# EAGLE schematic ShieldOV7670FlatCable (EAGLE 9.4.2)
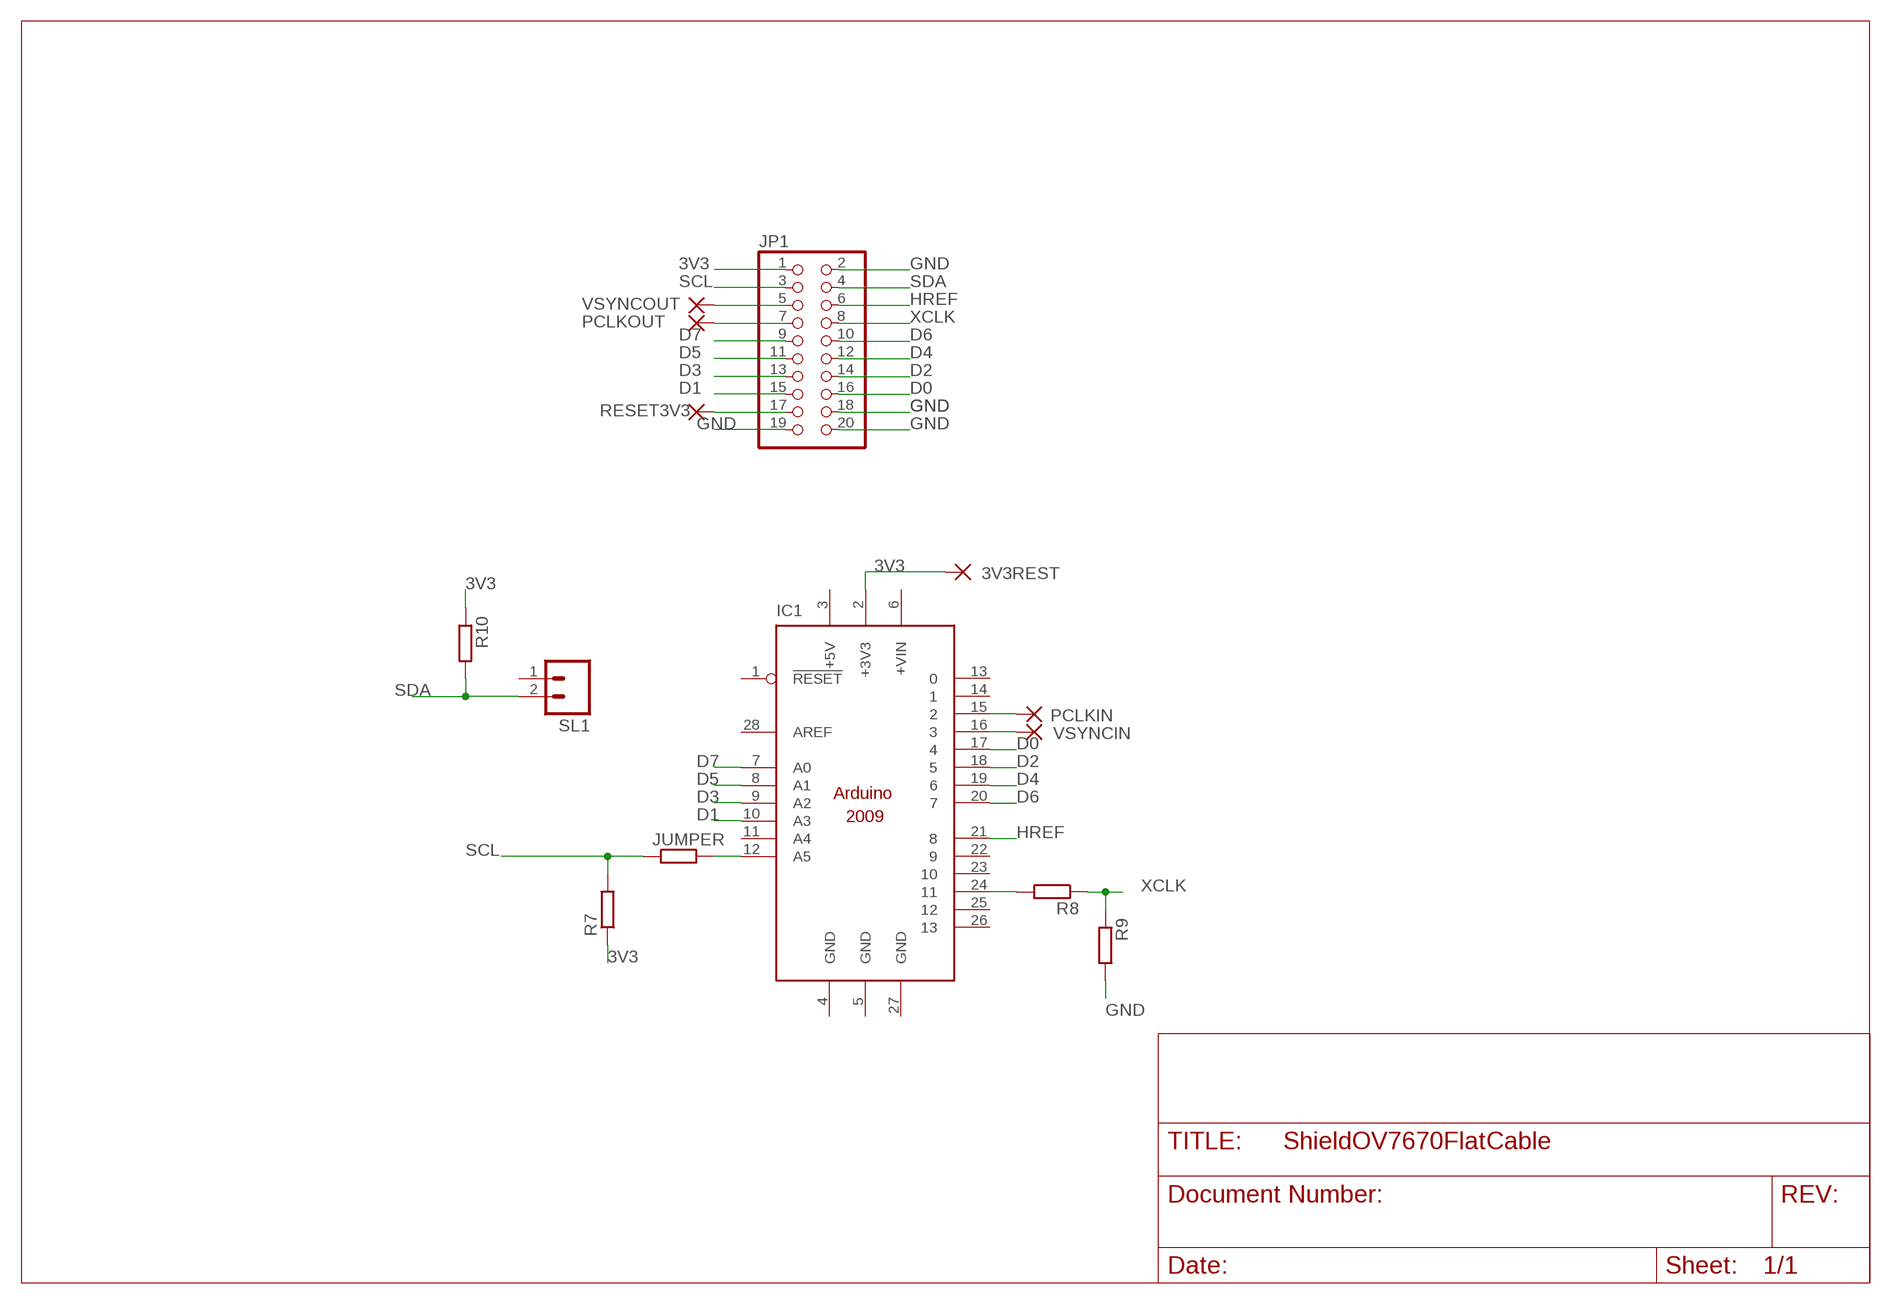
[diagram p0: schematic, sheet 1]

## Parts
3V3REST  1,6/0,9  [1,6/0,9]
IC1  ARDUINO2009_12  [ARDUINO2009_2]
JP1  PINHD-2X10  [2X10]
JUMPER  R-EU_0207/12  [0207/12]
PCLKIN  1,6/0,9  [1,6/0,9]
PCLKOUT  1,6/0,9  [1,6/0,9]
R7  R-EU_0207/12  [0207/12]
R8  R-EU_0207/12  [0207/12]
R9  R-EU_0207/12  [0207/12]
R10  R-EU_0207/12  [0207/12]
RESET3V3  1,6/0,9  [1,6/0,9]
SL1  M02  [02P]
VSYNCIN  1,6/0,9  [1,6/0,9]
VSYNCOUT  1,6/0,9  [1,6/0,9]

## Nets
3V3: 3V3REST.1(P) IC1.2(+3V3) JP1.1 R7.1 R10.1
D0: IC1.17 JP1.16
D1: IC1.10(A3) JP1.15
D2: IC1.18 JP1.14
D3: IC1.9(A2) JP1.13
D4: IC1.19 JP1.12
D5: IC1.8(A1) JP1.11
D6: IC1.20 JP1.10
D7: IC1.7(A0) JP1.9
GND: JP1.2 JP1.18 JP1.19 JP1.20 R9.2
HREF: IC1.21 JP1.6
N$1: IC1.15 PCLKIN.1(P)
N$2: IC1.16 VSYNCIN.1(P)
N$3: JP1.5 VSYNCOUT.1(P)
N$4: JP1.7 PCLKOUT.1(P)
N$5: IC1.12(A5) JUMPER.2
N$6: JP1.17 RESET3V3.1(P)
N$7: IC1.24 R8.2
SCL: JP1.3 JUMPER.1 R7.2
SDA: JP1.4 R10.2 SL1.2
XCLK: JP1.8 R8.1 R9.1
Unconnected: IC1.1(!RESET) IC1.6(+VIN) IC1.11(A4) IC1.13 IC1.14 IC1.22 IC1.23 IC1.25 IC1.26 IC1.28(AREF) SL1.1

## Power pins joined to a net without a drawn wire
+5V: IC1.3(+5V)
GND: IC1.4(GND) IC1.5(GND) IC1.27(GND)

## Library data of the parts
3V3REST PCLKIN PCLKOUT RESET3V3 VSYNCIN VSYNCOUT = wirepad:1,6/0,9: THROUGH-HOLE PAD
IC1 = arduino:ARDUINO2009_1: The Arduino Duemilanove ("2009") is a microcontroller board based on the ATmega168 or ATmega328. - 14 digital input/output pins (of which 6 can be used as PWM outputs) - 6 analog inputs, a 16 MHz crystal oscillator - USB connection - power jack - ISP header - reset button It contains everything needed to support the microcontroller; simply connect it to a computer with a USB cable or power it with a AC-to-DC adapter or battery to get started http://arduino.cc/en/Main/ArduinoBoardDuemilanove
JP1 = pinhead:PINHD-2X10: PIN HEADER
JUMPER R7-R10 = rcl:R-EU_: RESISTOR, European symbol; SPICEPREFIX: R
SL1 = con-amp-quick:M02: AMP QUICK CONNECTOR; OC_FARNELL: unknown; OC_NEWARK: unknown